# Altium project make_etf_great_again.PrjPcb
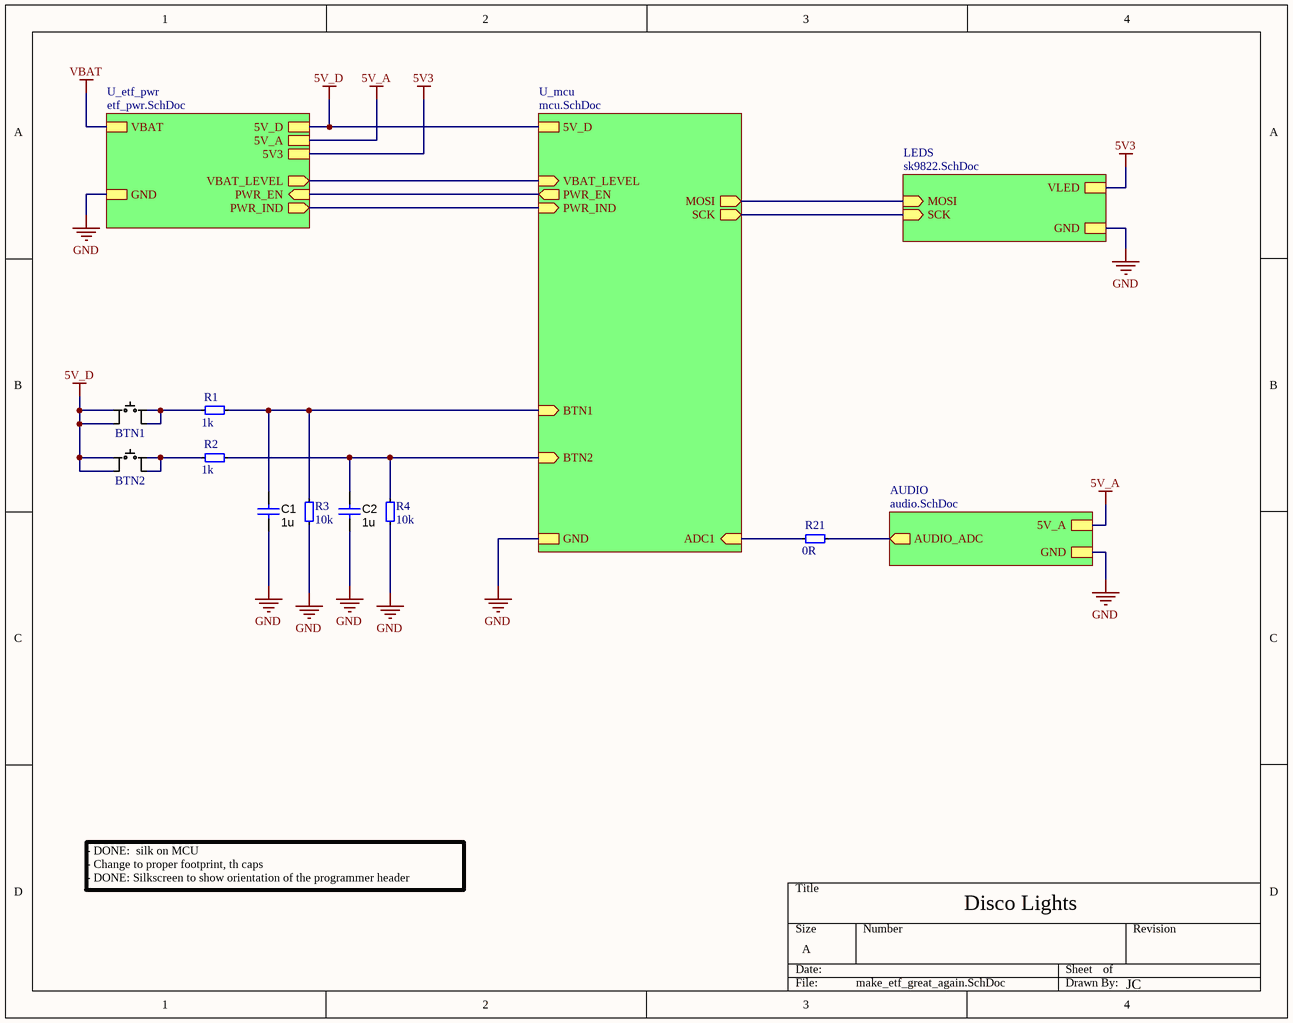
[diagram p0: make_etf_great_again.SchDoc]
Author: JC; Title: Disco Lights
4 sheets, 61 parts. Net scope: strictly hierarchical (ports join the sheet entries above them; power ports are local).
Board file: etf_blink.PcbDoc
Sheets:
  make_etf_great_again.SchDoc
    U_etf_pwr = etf_pwr.SchDoc
    AUDIO = audio.SchDoc
    U_mcu = mcu.SchDoc

## Sheet make_etf_great_again.SchDoc: Disco Lights
size A; SheetNumber: 1; SheetTotal: 5

### Parts
BTN1  Tactile Button  [SW_TS02-66-150-BK-160-LCR-D]  (value not drawn)
BTN2  Tactile Button  [SW_TS02-66-150-BK-160-LCR-D]  (value not drawn)
C1  value 1u  [1206_180]  (hidden comment: CAP, 1206)
C2  value 1u  [1206_180]  (hidden comment: CAP, 1206)
R1  value 1k  [0603]  (hidden comment: 0603, resistor)
R2  value 1k  [0603]  (hidden comment: 0603, resistor)
R3  value 10k  [0603]  (hidden comment: 0603, resistor)
R4  value 10k  [0603]  (hidden comment: 0603, resistor)
R21  value 0R  [0603]  (hidden comment: 0603, resistor)

### Sub-sheets
AUDIO = audio.SchDoc: AUDIO_ADC (out), 5V_A, GND
LEDS = sk9822.SchDoc (file not in this document): MOSI (in), SCK (in), VLED, GND
U_etf_pwr = etf_pwr.SchDoc: 5V_D, 5V_A, GND, VBAT_LEVEL (out), PWR_EN (in), VBAT, 5V3, PWR_IND (out)
U_mcu = mcu.SchDoc: MOSI (out), SCK (out), 5V_D, GND, BTN1 (in), BTN2 (in), ADC1 (in), PWR_EN (out), VBAT_LEVEL (in), PWR_IND (in)

### Nets
5V3: sheet LEDS/VLED, sheet U_etf_pwr/5V3
5V_A: sheet U_etf_pwr/5V_A, sheet AUDIO/5V_A
5V_D: BTN1.3 BTN1.4 BTN2.3 BTN2.4 ; sheet U_etf_pwr/5V_D, sheet U_mcu/5V_D
GND: C1.2 C2.2 R3.1 R4.1 ; sheet LEDS/GND, sheet U_etf_pwr/GND, sheet AUDIO/GND, sheet U_mcu/GND
ADC1: R21.1 ; sheet U_mcu/ADC1
AUDIO_ADC: R21.0 ; sheet AUDIO/AUDIO_ADC
BTN1: C1.1 R1.0 R3.0 ; sheet U_mcu/BTN1
BTN2: C2.1 R2.0 R4.0 ; sheet U_mcu/BTN2
MOSI: sheet LEDS/MOSI, sheet U_mcu/MOSI
PWR_EN: sheet U_etf_pwr/PWR_EN, sheet U_mcu/PWR_EN
PWR_IND: sheet U_etf_pwr/PWR_IND, sheet U_mcu/PWR_IND
SCK: sheet LEDS/SCK, sheet U_mcu/SCK
VBAT_LEVEL: sheet U_etf_pwr/VBAT_LEVEL, sheet U_mcu/VBAT_LEVEL
NetBTN1_1: BTN1.1 BTN1.2 R1.1
NetBTN2_1: BTN2.1 BTN2.2 R2.1

### Notes on the sheet
- - DONE:  silk on MCU
  - Change to proper footprint, th caps
  - DONE: Silkscreen to show orientation of the programmer header

### Library data of the parts
BTN1 BTN2 = TacButton TH: Tactile Switch Small Low; Mount: No; Value: Button
C1 C2 = CAP, 1206: Manufacturer Part Number: CC1206JKX7R7BB105; JLCPCB Part #: C1848; Mount: Yes
R1-R4 R21 = 0603, resistor: Manufacturer Part Number: RC0603JR-070RL; Mount: Yes
  R1 R2: JLCPCB Part #: C21190
  R3 R4: JLCPCB Part #: C98220
  R21: JLCPCB Part #: C95177

## Sheet etf_pwr.SchDoc: Disco Lights
size A4; SheetNumber: 3; SheetTotal: 5
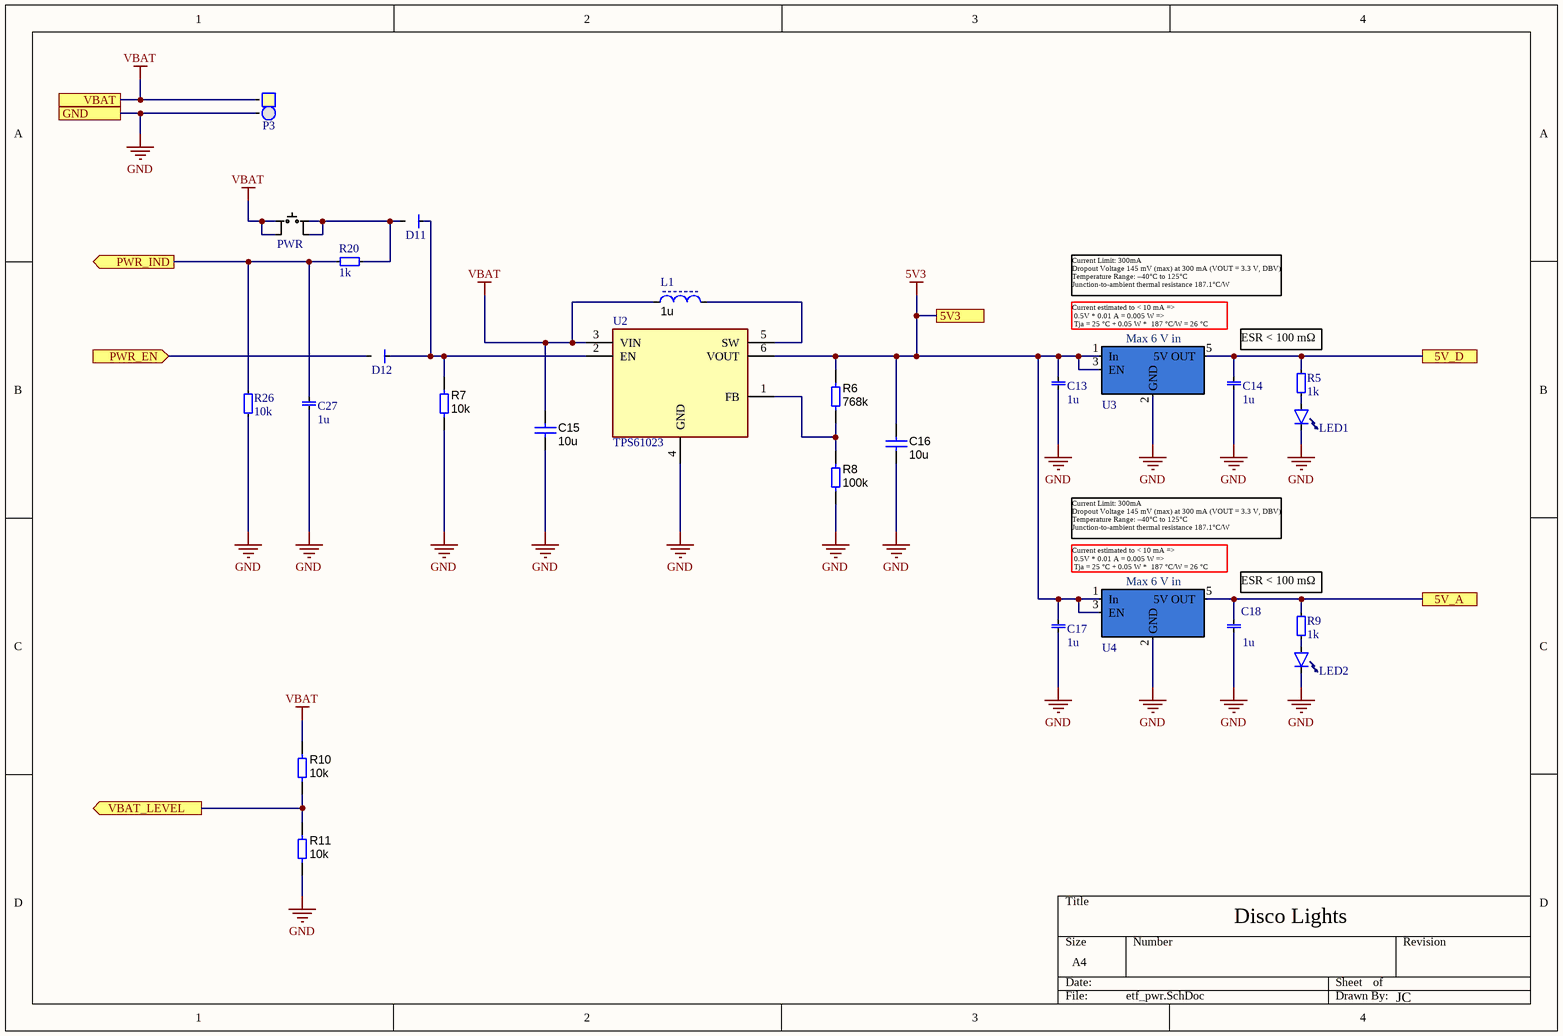
[diagram p1: etf_pwr.SchDoc]

### Parts
C13  value 1u  [0603 cap]  (hidden comment: 0603, capacitor)
C14  value 1u  [0603 cap]  (hidden comment: 0603, capacitor)
C15  value 10u  [1206_180]  (hidden comment: CAP, 1206)
C16  value 10u  [1206_180]  (hidden comment: CAP, 1206)
C17  value 1u  [0603 cap]  (hidden comment: 0603, capacitor)
C18  value 1u  [0603 cap]  (hidden comment: 0603, capacitor)
C27  value 1u  [0603 cap]  (hidden comment: 0603, capacitor)
D11  Diode, SMD  [SOD323]  (value not drawn)
D12  Diode, SMD  [SOD323]  (value not drawn)
L1  value 1u  [XEL4030-102MEC]  (hidden comment: Inductor, 1616)
LED1  0805, LED  [0805_led]  (value not drawn)
LED2  0805, LED  [0805_led]  (value not drawn)
P3  1x2 Pin Header  [padtwo_L]  (value not drawn)
PWR  Tactile Button  [SW_TS02-66-150-BK-160-LCR-D]  (value not drawn)
R5  value 1k  [0603]  (hidden comment: 0603, resistor)
R6  value 768k  [0603]  (hidden comment: RES, 0603)
R7  value 10k  [0603]  (hidden comment: RES, 0603)
R8  value 100k  [0603]  (hidden comment: RES, 0603)
R9  value 1k  [0603]  (hidden comment: 0603, resistor)
R10  value 10k  [0603]  (hidden comment: RES, 0603)
R11  value 10k  [0603]  (hidden comment: RES, 0603)
R20  value 1k  [0603]  (hidden comment: 0603, resistor)
R26  value 10k  [0603]  (hidden comment: 0603, resistor)
U2  TPS61023  [SOT50P160X60-6N]
U3  TPS7A20  [SOT23-5]  (value not drawn)
U4  TPS7A20  [SOT23-5]  (value not drawn)

### Ports
5V3, 5V_A, 5V_D, GND, PWR_EN (in), PWR_IND (out), VBAT, VBAT_LEVEL (out)

### Nets
5V3: C13.1 C16.1 C17.1 R6.2 U2.6(VOUT) U3.1(In) U3.3(EN) U4.1(In) U4.3(EN) ; port 5V3
5V_A: C18.1 R9.1 U4.5(5V_OUT) ; port 5V_A
5V_D: C14.1 R5.1 U3.5(5V_OUT) ; port 5V_D
GND: C13.0 C14.0 C15.2 C16.2 C17.0 C18.0 C27.0 LED1.0(Cathode) LED2.0(Cathode) P3.2 R7.1 R8.1 R11.1 R26.0 U2.4(GND) U3.2(GND) U4.2(GND) ; port GND
VBAT: C15.1 L1.2 P3.1 PWR.3 PWR.4 R10.2 U2.3(VIN) ; port VBAT
PWR_EN: D12.2 ; port PWR_EN
PWR_IND: C27.1 R20.0 R26.1 ; port PWR_IND
VBAT_LEVEL: R10.1 R11.2 ; port VBAT_LEVEL
NetD11_1: D11.1 D12.1 R7.2 U2.2(EN)
NetD11_2: D11.2 PWR.1 PWR.2 R20.1
NetL1_1: L1.1 U2.5(SW)
NetLED1_1: LED1.1 R5.0
NetLED2_1: LED2.1 R9.0
NetR6_1: R6.1 R8.2 U2.1(FB)

### Notes on the sheet
- Current Limit: 300mA
  Dropout Voltage 145 mV (max) at 300 mA (VOUT = 3.3 V, DBV)
  Temperature Range: –40°C to 125°C
  Junction-to-ambient thermal resistance 187.1°C/W
- (near U3) Current estimated to < 10 mA =>
  0.5V * 0.01 A = 0.005 W =>
  Tja = 25 °C + 0.05 W *  187 °C/W = 26 °C
- ESR < 100 mΩ
- (near U4) Current estimated to < 10 mA =>
  0.5V * 0.01 A = 0.005 W =>
  Tja = 25 °C + 0.05 W *  187 °C/W = 26 °C
- (in symbol TPS7A20) Max 6 V in

### Library data of the parts
C13 C14 C17 C18 C27 = 0603, capacitor: Manufacturer Part Number: GRM188R61H105KAALD; JLCPCB Part #: C77386; Mount: Yes
C15 C16 = CAP, 1206: Manufacturer Part Number: C3216X7R1C106KT000N; JLCPCB Part #: C342827; Mount: Yes
D11 D12 = Diode, SMD: Manufacturer Part Number: BAT760,115; JLCPCB Part #: C117941; Mount: Yes
L1 = Inductor, 1616: Shielded Power Inductor with Ferrite Core; Manufacturer Part Number: SRN4018BTA-1R0Y; AC Current: 1; Mount: No; DC Resistance: 1; JLCPCB Part #: C19947630
LED1 LED2 = 0805, LED: Manufacturer Part Number: KP-2012SURCK; Value: 0805 LED; JLCPCB Part #: C2295; Mount: Yes
P3 = 1x2 Pin Header: 2.54 mm, TH; Mount: No; Value: 1x2 Pin Header
PWR = TacButton TH: Tactile Switch Small Low; Mount: No; Value: Button
R5 R9 R20 = 0603, resistor: Manufacturer Part Number: CR0603-FX-1001ELF; JLCPCB Part #: C21190; Mount: Yes
R6 = RES, 0603: Manufacturer Part Number: CR0603F768KP05Z; JLCPCB Part #: C2933258; Mount: Yes
R7 R10 R11 = RES, 0603: Manufacturer Part Number: RC0603FR-0710KL; JLCPCB Part #: C98220; Mount: Yes
R8 = RES, 0603: Manufacturer Part Number: RC0603FR-07100KL; JLCPCB Part #: C14675; Mount: Yes
R26 = 0603, resistor: Manufacturer Part Number: RC0603FR-0710KL; JLCPCB Part #: C98220; Mount: Yes
U2 = TPS61023: TPS61023 3.7-A Boost Converter with 0.5-V Ultra-low Input Voltage; Manufacturer Part Number: TPS61023DRLR; JLCPCB Part #: C919459; Mount: Yes
U3 U4 = TPS7A20: 5V and 300-mA, Ultra-Low-Noise, Low-IQ, High PSRR LDO; Manufacturer Part Number: TPS7A2045PDBVR; JLCPCB Part #: C2873627; Mount: Yes

## Sheet audio.SchDoc: Disco Lights
size A; SheetNumber: 4; SheetTotal: 5
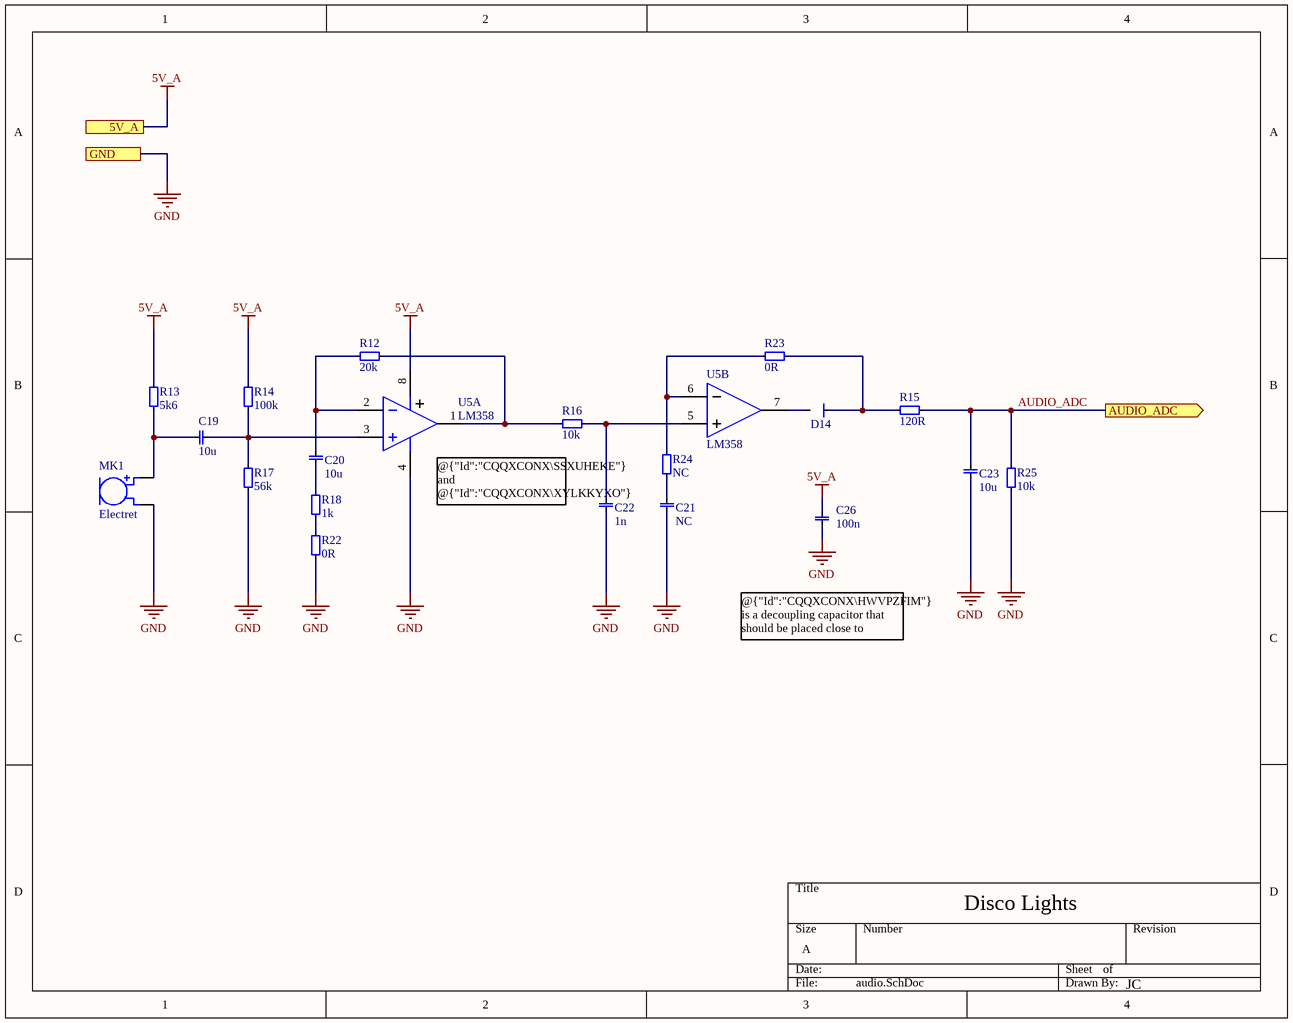
[diagram p2: audio.SchDoc]

### Parts
C19  value 10u  [0603 cap]  (hidden comment: 0603, capacitor)
C20  value 10u  [0603 cap]  (hidden comment: 0603, capacitor)
C21  value NC  [0603 cap]  (hidden comment: 0603, capacitor)
C22  value 1n  [0603 cap]  (hidden comment: 0603, capacitor)
C23  value 10u  [0603 cap]  (hidden comment: 0603, capacitor)
C26  value 100n  [0603 cap]  (hidden comment: 0603, capacitor)
D14  Diode, SMD  [SOD323]  (value not drawn)
MK1  Electret  [ElectretMic_9.7mm_6.7mm]
R12  value 20k  [0603]  (hidden comment: 0603, resistor)
R13  value 5k6  [0603]  (hidden comment: 0603, resistor)
R14  value 100k  [0603]  (hidden comment: 0603, resistor)
R15  value 120R  [0603]  (hidden comment: 0603, resistor)
R16  value 10k  [0603]  (hidden comment: 0603, resistor)
R17  value 56k  [0603]  (hidden comment: 0603, resistor)
R18  value 1k  [0603]  (hidden comment: 0603, resistor)
R22  value 0R  [0603]  (hidden comment: 0603, resistor)
R23  value 0R  [0603]  (hidden comment: 0603, resistor)
R24  value NC  [0603]  (hidden comment: 0603, resistor)
R25  value 10k  [0603]  (hidden comment: 0603, resistor)
U5  LM358  [SOIC8]  (parts A,B of 2)

### Ports
5V_A, AUDIO_ADC (out), GND

### Nets
5V_A: C26.1 R13.0 R14.0 U5.8(V+) ; port 5V_A
GND: C21.0 C22.0 C23.1 C26.0 MK1.2 R17.1 R22.0 R25.1 U5.4(V-) ; port GND
AUDIO_ADC: C23.0 R15.1 R25.0 ; port AUDIO_ADC
NetC19_0: C19.0 R14.1 R17.0 U5.3(IN+)
NetC19_1: C19.1 MK1.1 R13.1
NetC20_0: C20.0 R18.0
NetC20_1: C20.1 R12.0 U5.2(IN-)
NetC21_1: C21.1 R24.1
NetC22_1: C22.1 R16.1 U5.5(IN+)
NetD14_1: D14.1 R15.0 R23.1
NetD14_2: D14.2 U5.7(OUT2)
NetR12_1: R12.1 R16.0 U5.1(OUT1)
NetR18_1: R18.1 R22.1
NetR23_0: R23.0 R24.0 U5.6(IN-)

### Notes on the sheet
- (near U5) @{"Id":"CQQXCONX\SSXUHEKE"} and @{"Id":"CQQXCONX\XYLKKYXO"} should have a time constant of 110 ms (2.2 1/20 Hz)
- @{"Id":"CQQXCONX\HWVPZFIM"} is a decoupling capacitor that should be placed close to @{"Id":"CQQXCONX\QJIXHWMY"}/ @{"Id":"CQQXCONX\NZEVYOYY"}.

### Library data of the parts
C19 C20 C23 = 0603, capacitor: Manufacturer Part Number: TMK107BBJ106MA-T; JLCPCB Part #: C386081; Mount: Yes
C21 = 0603, capacitor: Mount: No
C22 C26 = 0603, capacitor: Manufacturer Part Number: CC0603KRX7R9BB102; Mount: Yes
  C22: JLCPCB Part #: C100040
  C26: JLCPCB Part #: C14663
D14 = Diode, SMD: Manufacturer Part Number: BAT760,115; JLCPCB Part #: C117941; Mount: Yes
MK1 = Electret Mic: D9.7mm H6.7mm, Electrokit art nr: 40290007; Mount: No
R12 = 0603, resistor: Manufacturer Part Number: RT0603BRD0720KL; JLCPCB Part #: C723637; Mount: Yes
R13 = 0603, resistor: Manufacturer Part Number: AC0603FR-075K6L; JLCPCB Part #: C138278; Mount: Yes
R14 = 0603, resistor: Manufacturer Part Number: RC0603FR-07100KL; JLCPCB Part #: C14675; Mount: Yes
R15 = 0603, resistor: Manufacturer Part Number: RC0603JR-07120RL; JLCPCB Part #: C114681; Mount: Yes
R16 R25 = 0603, resistor: as R26 on sheet etf_pwr; JLCPCB Part #: C98220; Mount: Yes
R17 = 0603, resistor: Manufacturer Part Number: C3216X7R1C106KT000N; JLCPCB Part #: C114630; Mount: Yes
R18 = 0603, resistor: as R5 on sheet etf_pwr; JLCPCB Part #: C21190; Mount: Yes
R22 R23 = 0603, resistor: Manufacturer Part Number: RC0603JR-070RL; JLCPCB Part #: C95177; Mount: Yes
R24 = 0603, resistor: Mount: No
U5 = LM358: Dual FET-Input Operational Amplifier; Value: 595-LM358P; Mount: No

## Sheet mcu.SchDoc: Disco Lights
size A4; SheetNumber: 5; SheetTotal: 5
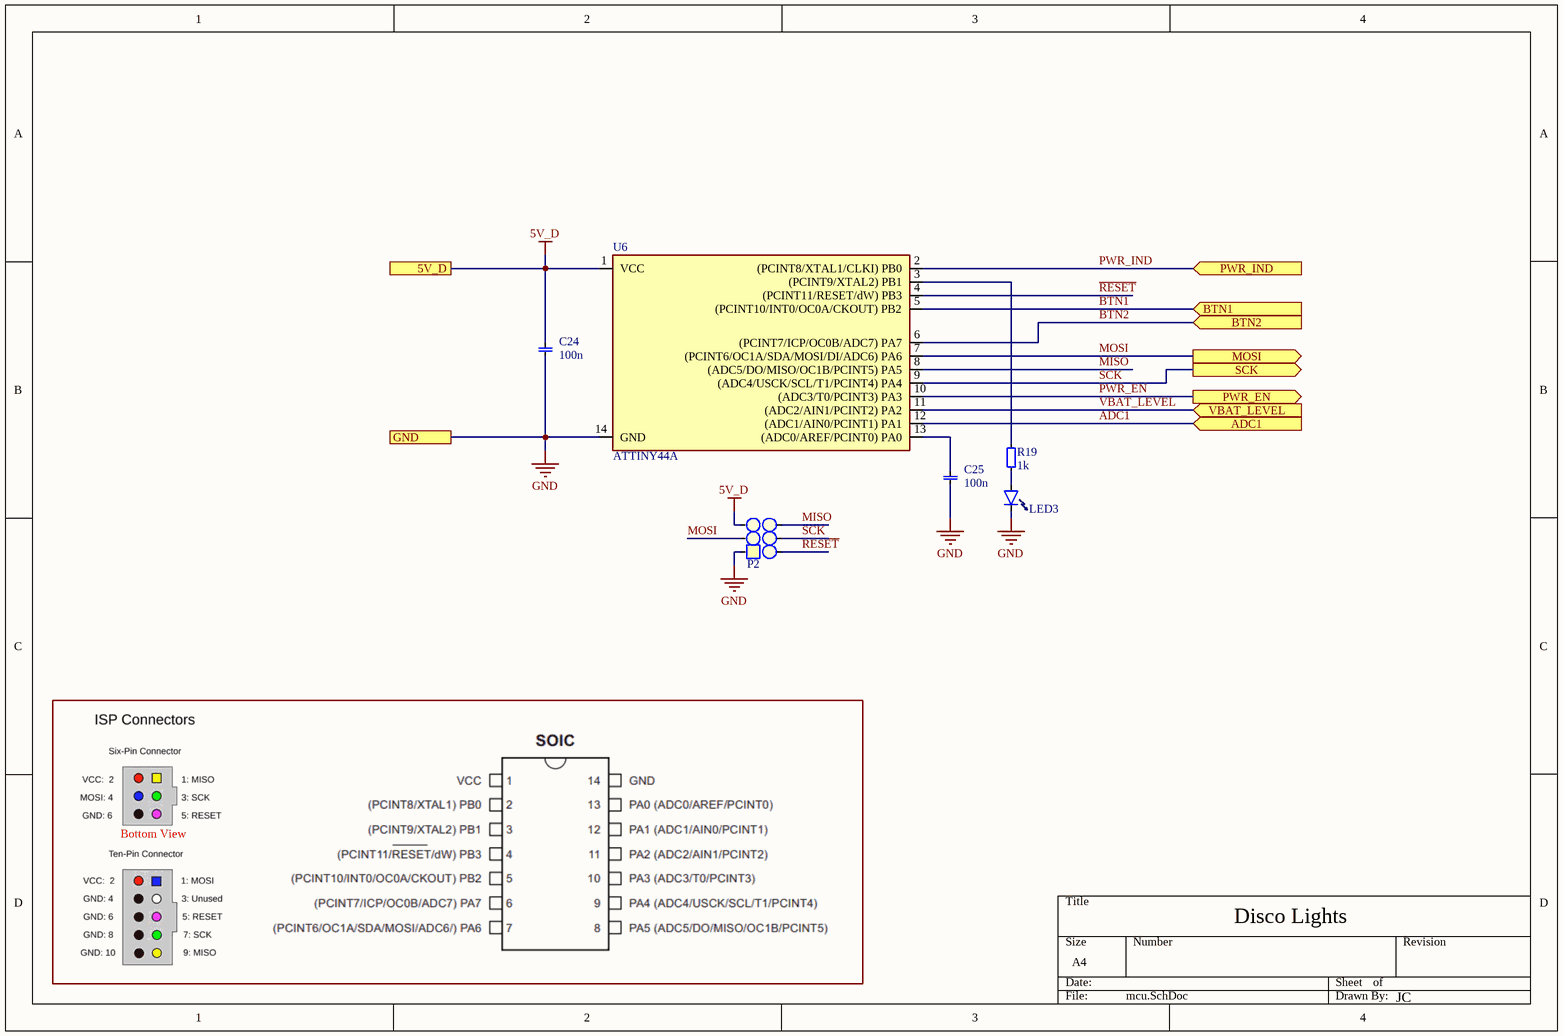
[diagram p3: mcu.SchDoc]

### Parts
C24  value 100n  [0603 cap]  (hidden comment: 0603, capacitor)
C25  value 100n  [0603 cap]  (hidden comment: 0603, capacitor)
LED3  0805, LED  [0805_led]  (value not drawn)
P2  2x3 Pin Header  [2x3 PH]  (value not drawn)
R19  value 1k  [0603]  (hidden comment: 0603, resistor)
U6  ATTINY44A  [DIP14]

### Ports
5V_D, ADC1 (in), BTN1 (in), BTN2 (in), GND, MOSI (out), PWR_EN (out), PWR_IND (in), SCK (out), VBAT_LEVEL (in)

### Nets
5V_D: C24.1 P2.3 U6.1(VCC) ; port 5V_D
GND: C24.0 C25.0 LED3.0(Cathode) P2.1 U6.14(GND) ; port GND
ADC1: U6.12((ADC1/AIN0/PCINT1)_PA1) ; port ADC1
BTN1: U6.5((PCINT10/INT0/OC0A/CKOUT)_PB2) ; port BTN1
BTN2: U6.6((PCINT7/ICP/OC0B/ADC7)_PA7) ; port BTN2
MISO: P2.4 U6.8((ADC5/DO/MISO/OC1B/PCINT5)_PA5)
MOSI: P2.2 U6.7((PCINT6/OC1A/SDA/MOSI/DI/ADC6)_PA6) ; port MOSI
PWR_EN: U6.10((ADC3/T0/PCINT3)_PA3) ; port PWR_EN
PWR_IND: U6.2((PCINT8/XTAL1/CLKI)_PB0) ; port PWR_IND
~{RESET}: P2.6 U6.4((PCINT11/RESET/dW)_PB3)
SCK: P2.5 U6.9((ADC4/USCK/SCL/T1/PCINT4)_PA4) ; port SCK
VBAT_LEVEL: U6.11((ADC2/AIN1/PCINT2)_PA2) ; port VBAT_LEVEL
NetC25_1: C25.1 U6.13((ADC0/AREF/PCINT0)_PA0)
NetLED3_1: LED3.1 R19.0
NetR19_1: R19.1 U6.3((PCINT9/XTAL2)_PB1)

### Notes on the sheet
- Bottom View

### Library data of the parts
C24 C25 = 0603, capacitor: as C22 on sheet audio; JLCPCB Part #: C14663; Mount: Yes
LED3 = 0805, LED: as LED1 on sheet etf_pwr; JLCPCB Part #: C2295; Mount: Yes
P2 = 2x3 Pin Header: Value: 2x3 Pin Header, 2.54mm; Mount: No
R19 = 0603, resistor: as R5 on sheet etf_pwr; JLCPCB Part #: C21190; Mount: Yes
U6 = ATTINY44A: 8-bit microcontrollers based on the AVR® enhanced RISC / architecture.; JLCPCB Part #: C2325; Mount: Yes

## Nets that join several sheets
5V_A: etf_pwr (C18.1 R9.1 U4.5), audio (C26.1 R13.0 R14.0 U5.8)
5V_D: make_etf_great_again (BTN1.3 BTN1.4 BTN2.3 BTN2.4), etf_pwr (C14.1 R5.1 U3.5), mcu (C24.1 P2.3 U6.1)
GND: make_etf_great_again (C1.2 C2.2 R3.1 R4.1), etf_pwr (17 pins), audio (9 pins), mcu (5 pins)
ADC1: make_etf_great_again (R21.1), mcu (U6.12)
AUDIO_ADC: make_etf_great_again (R21.0), audio (C23.0 R15.1 R25.0)
BTN1: make_etf_great_again (C1.1 R1.0 R3.0), mcu (U6.5)
BTN2: make_etf_great_again (C2.1 R2.0 R4.0), mcu (U6.6)
PWR_EN: etf_pwr (D12.2), mcu (U6.10)
PWR_IND: etf_pwr (C27.1 R20.0 R26.1), mcu (U6.2)
VBAT_LEVEL: etf_pwr (R10.1 R11.2), mcu (U6.11)